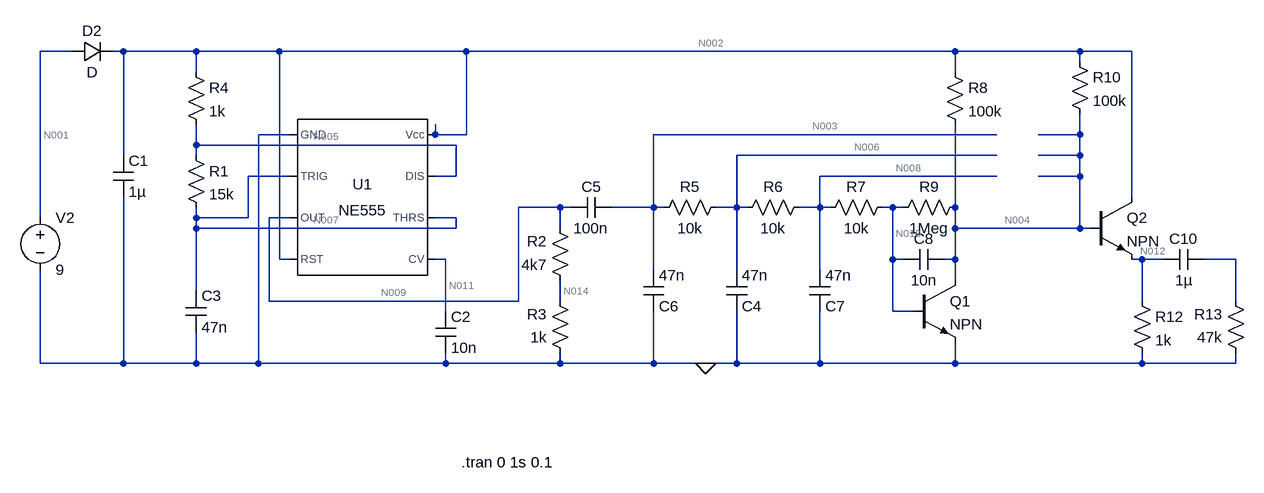
[diagram p0: schematic NE555SignalGenerator.asc]
NE555SignalGenerator.asc, the LTspice schematic file:
Version 4
SHEET 1 1924 680
WIRE 112 -96 64 -96
WIRE 192 -96 176 -96
WIRE 304 -96 192 -96
WIRE 432 -96 304 -96
WIRE 720 -96 432 -96
WIRE 1472 -96 720 -96
WIRE 1664 -96 1472 -96
WIRE 1744 -96 1664 -96
WIRE 1664 -80 1664 -96
WIRE 304 -64 304 -96
WIRE 1472 -64 1472 -96
WIRE 448 32 400 32
WIRE 672 32 672 16
WIRE 720 32 720 -96
WIRE 720 32 672 32
WIRE 1536 32 1008 32
WIRE 1664 32 1664 0
WIRE 1664 32 1600 32
WIRE 304 48 304 16
WIRE 704 48 304 48
WIRE 192 64 192 -96
WIRE 304 64 304 48
WIRE 1536 64 1136 64
WIRE 1664 64 1664 32
WIRE 1664 64 1600 64
WIRE 448 96 384 96
WIRE 704 96 704 48
WIRE 704 96 672 96
WIRE 1536 96 1264 96
WIRE 1664 96 1664 64
WIRE 1664 96 1600 96
WIRE 1744 128 1744 -96
WIRE 864 144 800 144
WIRE 880 144 864 144
WIRE 1008 144 1008 32
WIRE 1008 144 944 144
WIRE 1024 144 1008 144
WIRE 1136 144 1136 64
WIRE 1136 144 1104 144
WIRE 1152 144 1136 144
WIRE 1264 144 1264 96
WIRE 1264 144 1232 144
WIRE 1280 144 1264 144
WIRE 1376 144 1360 144
WIRE 1392 144 1376 144
WIRE 1472 144 1472 16
WIRE 64 160 64 -96
WIRE 304 160 304 144
WIRE 384 160 384 96
WIRE 384 160 304 160
WIRE 448 160 416 160
WIRE 704 160 672 160
WIRE 304 176 304 160
WIRE 704 176 704 160
WIRE 704 176 304 176
WIRE 864 176 864 144
WIRE 1472 176 1472 144
WIRE 1664 176 1664 96
WIRE 1664 176 1472 176
WIRE 1680 176 1664 176
WIRE 432 224 432 -96
WIRE 448 224 432 224
WIRE 688 224 672 224
WIRE 1376 224 1376 144
WIRE 1392 224 1376 224
WIRE 1472 224 1472 176
WIRE 1472 224 1456 224
WIRE 1760 224 1744 224
WIRE 1792 224 1760 224
WIRE 1904 224 1856 224
WIRE 1008 240 1008 144
WIRE 1136 240 1136 144
WIRE 1264 240 1264 144
WIRE 1472 256 1472 224
WIRE 304 272 304 176
WIRE 416 288 416 160
WIRE 800 288 800 144
WIRE 800 288 416 288
WIRE 864 288 864 256
WIRE 1760 288 1760 224
WIRE 1904 288 1904 224
WIRE 688 304 688 224
WIRE 1376 304 1376 224
WIRE 1408 304 1376 304
WIRE 64 384 64 240
WIRE 192 384 192 128
WIRE 192 384 64 384
WIRE 304 384 304 336
WIRE 304 384 192 384
WIRE 400 384 400 32
WIRE 400 384 304 384
WIRE 688 384 688 368
WIRE 688 384 400 384
WIRE 864 384 864 368
WIRE 864 384 688 384
WIRE 1008 384 1008 304
WIRE 1008 384 864 384
WIRE 1088 384 1008 384
WIRE 1136 384 1136 304
WIRE 1136 384 1088 384
WIRE 1264 384 1264 304
WIRE 1264 384 1136 384
WIRE 1472 384 1472 352
WIRE 1472 384 1264 384
WIRE 1760 384 1760 368
WIRE 1760 384 1472 384
WIRE 1904 384 1904 368
WIRE 1904 384 1760 384
FLAG 1088 384 0
SYMBOL Voltage 64 144 R0
SYMATTR InstName V2
SYMATTR Value 9
SYMBOL Diode 112 -80 R270
WINDOW 0 32 32 VTop 2
WINDOW 3 0 32 VBottom 2
SYMATTR InstName D2
SYMBOL Cap 176 64 R0
SYMATTR InstName C1
SYMATTR Value 1µ
SYMBOL Res 288 48 R0
SYMATTR InstName R1
SYMATTR Value 15k
SYMBOL Misc/NE555 560 128 R0
SYMATTR InstName U1
SYMBOL Cap 672 304 R0
SYMATTR InstName C2
SYMATTR Value 10n
SYMBOL Cap 288 272 R0
SYMATTR InstName C3
SYMATTR Value 47n
SYMBOL Cap 944 128 R90
WINDOW 0 0 32 VBottom 2
WINDOW 3 32 32 VTop 2
SYMATTR InstName C5
SYMATTR Value 100n
SYMBOL Res 880 272 R180
WINDOW 0 36 76 Left 2
WINDOW 3 36 40 Left 2
SYMATTR InstName R2
SYMATTR Value 4k7
SYMBOL Res 880 384 R180
WINDOW 0 36 76 Left 2
WINDOW 3 36 40 Left 2
SYMATTR InstName R3
SYMATTR Value 1k
SYMBOL Res 288 -80 R0
SYMATTR InstName R4
SYMATTR Value 1k
SYMBOL Cap 992 240 R0
WINDOW 0 24 56 Left 2
WINDOW 3 24 8 Left 2
SYMATTR InstName C6
SYMATTR Value 47n
SYMBOL Res 1008 160 R270
WINDOW 0 32 56 VTop 2
WINDOW 3 0 56 VBottom 2
SYMATTR InstName R5
SYMATTR Value 10k
SYMBOL Cap 1120 240 R0
WINDOW 0 24 56 Left 2
WINDOW 3 24 8 Left 2
SYMATTR InstName C4
SYMATTR Value 47n
SYMBOL Res 1136 160 R270
WINDOW 0 32 56 VTop 2
WINDOW 3 0 56 VBottom 2
SYMATTR InstName R6
SYMATTR Value 10k
SYMBOL Res 1264 160 R270
WINDOW 0 32 56 VTop 2
WINDOW 3 0 56 VBottom 2
SYMATTR InstName R7
SYMATTR Value 10k
SYMBOL Cap 1248 240 R0
WINDOW 0 24 56 Left 2
WINDOW 3 24 8 Left 2
SYMATTR InstName C7
SYMATTR Value 47n
SYMBOL Res 1488 128 R90
WINDOW 0 0 56 VBottom 2
WINDOW 3 32 56 VTop 2
SYMATTR InstName R9
SYMATTR Value 1Meg
SYMBOL Cap 1456 208 R90
WINDOW 0 0 32 VBottom 2
WINDOW 3 32 32 VTop 2
SYMATTR InstName C8
SYMATTR Value 10n
SYMBOL npn3 1408 256 R0
SYMATTR InstName Q1
SYMBOL Res 1456 -80 R0
SYMATTR InstName R8
SYMATTR Value 100k
SYMBOL Res 1648 -96 R0
SYMATTR InstName R10
SYMATTR Value 100k
SYMBOL npn3 1680 128 R0
SYMATTR InstName Q2
SYMBOL Res 1744 272 R0
SYMATTR InstName R12
SYMATTR Value 1k
SYMBOL Cap 1856 208 R90
WINDOW 0 0 32 VBottom 2
WINDOW 3 32 32 VTop 2
SYMATTR InstName C10
SYMATTR Value 1µ
SYMBOL Res 1920 384 R180
WINDOW 0 36 76 Left 2
WINDOW 3 36 40 Left 2
SYMATTR InstName R13
SYMATTR Value 47k
TEXT 712 536 Left 2 !.tran 0 1s 0.1

The netlist it stands for:
* NE555SignalGenerator.asc
V2 N001 0 9
D2 N001 N002 D
C1 N002 0 1µ
R1 N005 N007 15k
XU1 0 N007 N009 N002 N011 N007 N005 N002 NE555  ; pins GND TRIG OUT RST CV THRS DIS Vcc
C2 N011 0 10n
C3 N007 0 47n
C5 N003 N009 100n
R2 N014 N009 4k7
R3 0 N014 1k
R4 N002 N005 1k
C6 N003 0 47n
R5 N003 N006 10k
C4 N006 0 47n
R6 N006 N008 10k
R7 N008 N010 10k
C7 N008 0 47n
R9 N004 N010 1Meg
C8 N004 N010 10n
Q1 N004 N010 0 0 NPN
R8 N002 N004 100k
R10 N002 N004 100k
Q2 N002 N004 N012 0 NPN
R12 N012 0 1k
C10 N013 N012 1µ
R13 0 N013 47k
.model D D
.lib standard.dio
.model NPN NPN
.model PNP PNP
.lib standard.bjt
.tran 0 1s 0.1
.lib NE555.sub
.backanno
.end

* Results of the author's LTspice run, read from the files saved beside the schematic
* Operating Point, zero values left out:
*   V(n001) = 9 V
*   V(n002) = 8.301 V
*   V(n005) = 8.301 V
*   V(n007) = 8.301 V
*   V(n011) = 5.534 V
*   V(n009) = 8.293 V
*   V(n003) = 718.6 mV
*   V(n014) = 1.455 V
*   V(n006) = 718.6 mV
*   V(n008) = 718.6 mV
*   V(n010) = 718.6 mV
*   V(n004) = 1.882 V
*   V(n012) = 1.105 V
*   Ic(Q1) = 116.3 µA
*   Ib(Q1) = 1.163 µA
*   Ie(Q1) = -117.5 µA
*   Ic(Q2) = 1.094 mA
*   Ib(Q2) = 10.94 µA
*   Ie(Q2) = -1.105 mA
*   I(D2) = 5.359 mA
*   I(R1) = 16.6 nA
*   I(R2) = -1.455 mA
*   I(R3) = -1.455 mA
*   I(R4) = 27.68 nA
*   I(R9) = 1.163 µA
*   I(R8) = 64.2 µA
*   I(R10) = 64.2 µA
*   I(R12) = 1.105 mA
*   I(V2) = -5.359 mA
*   Ix(u1:1) = -2.682 mA
*   Ix(u1:2) = 8.301 nA
*   Ix(u1:3) = -1.455 mA
*   Ix(u1:4) = 44.68 µA
*   Ix(u1:6) = 8.301 nA
*   Ix(u1:7) = 11.08 nA
*   Ix(u1:8) = 4.092 mA